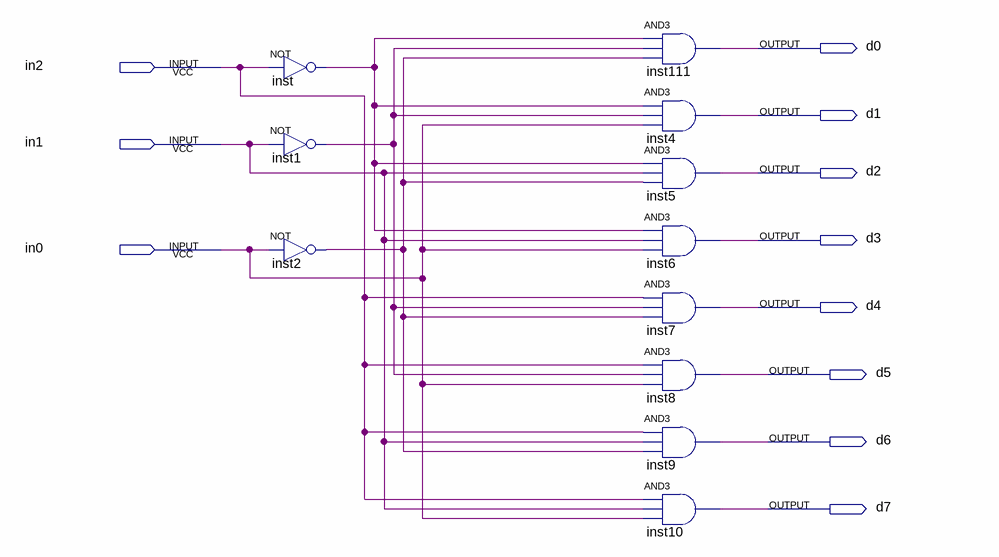
[diagram p0: schematic sheet]
// Quartus schematic ThreetoEight.bdf as structural Verilog: 11 symbols, 11 pins
module ThreetoEight (
  input  in2,
  input  in1,
  input  in0,
  output d0,
  output d1,
  output d2,
  output d3,
  output d4,
  output d5,
  output d6,
  output d7
);

  wire inst1_out, inst2_out, inst_out;

  not inst (inst_out, in2);
  not inst1 (inst1_out, in1);
  not inst2 (inst2_out, in0);
  and inst111 (d0, inst_out, inst1_out, inst2_out);
  and inst4 (d1, inst_out, inst1_out, in0);
  and inst5 (d2, inst_out, in1, inst2_out);
  and inst6 (d3, inst_out, in1, in0);
  and inst7 (d4, in2, inst1_out, inst2_out);
  and inst8 (d5, in2, inst1_out, in0);
  and inst9 (d6, in2, in1, inst2_out);
  and inst10 (d7, in2, in1, in0);
endmodule
